# EAGLE design T-Board-328 PCB - v0.3 (EAGLE 6.5.0)
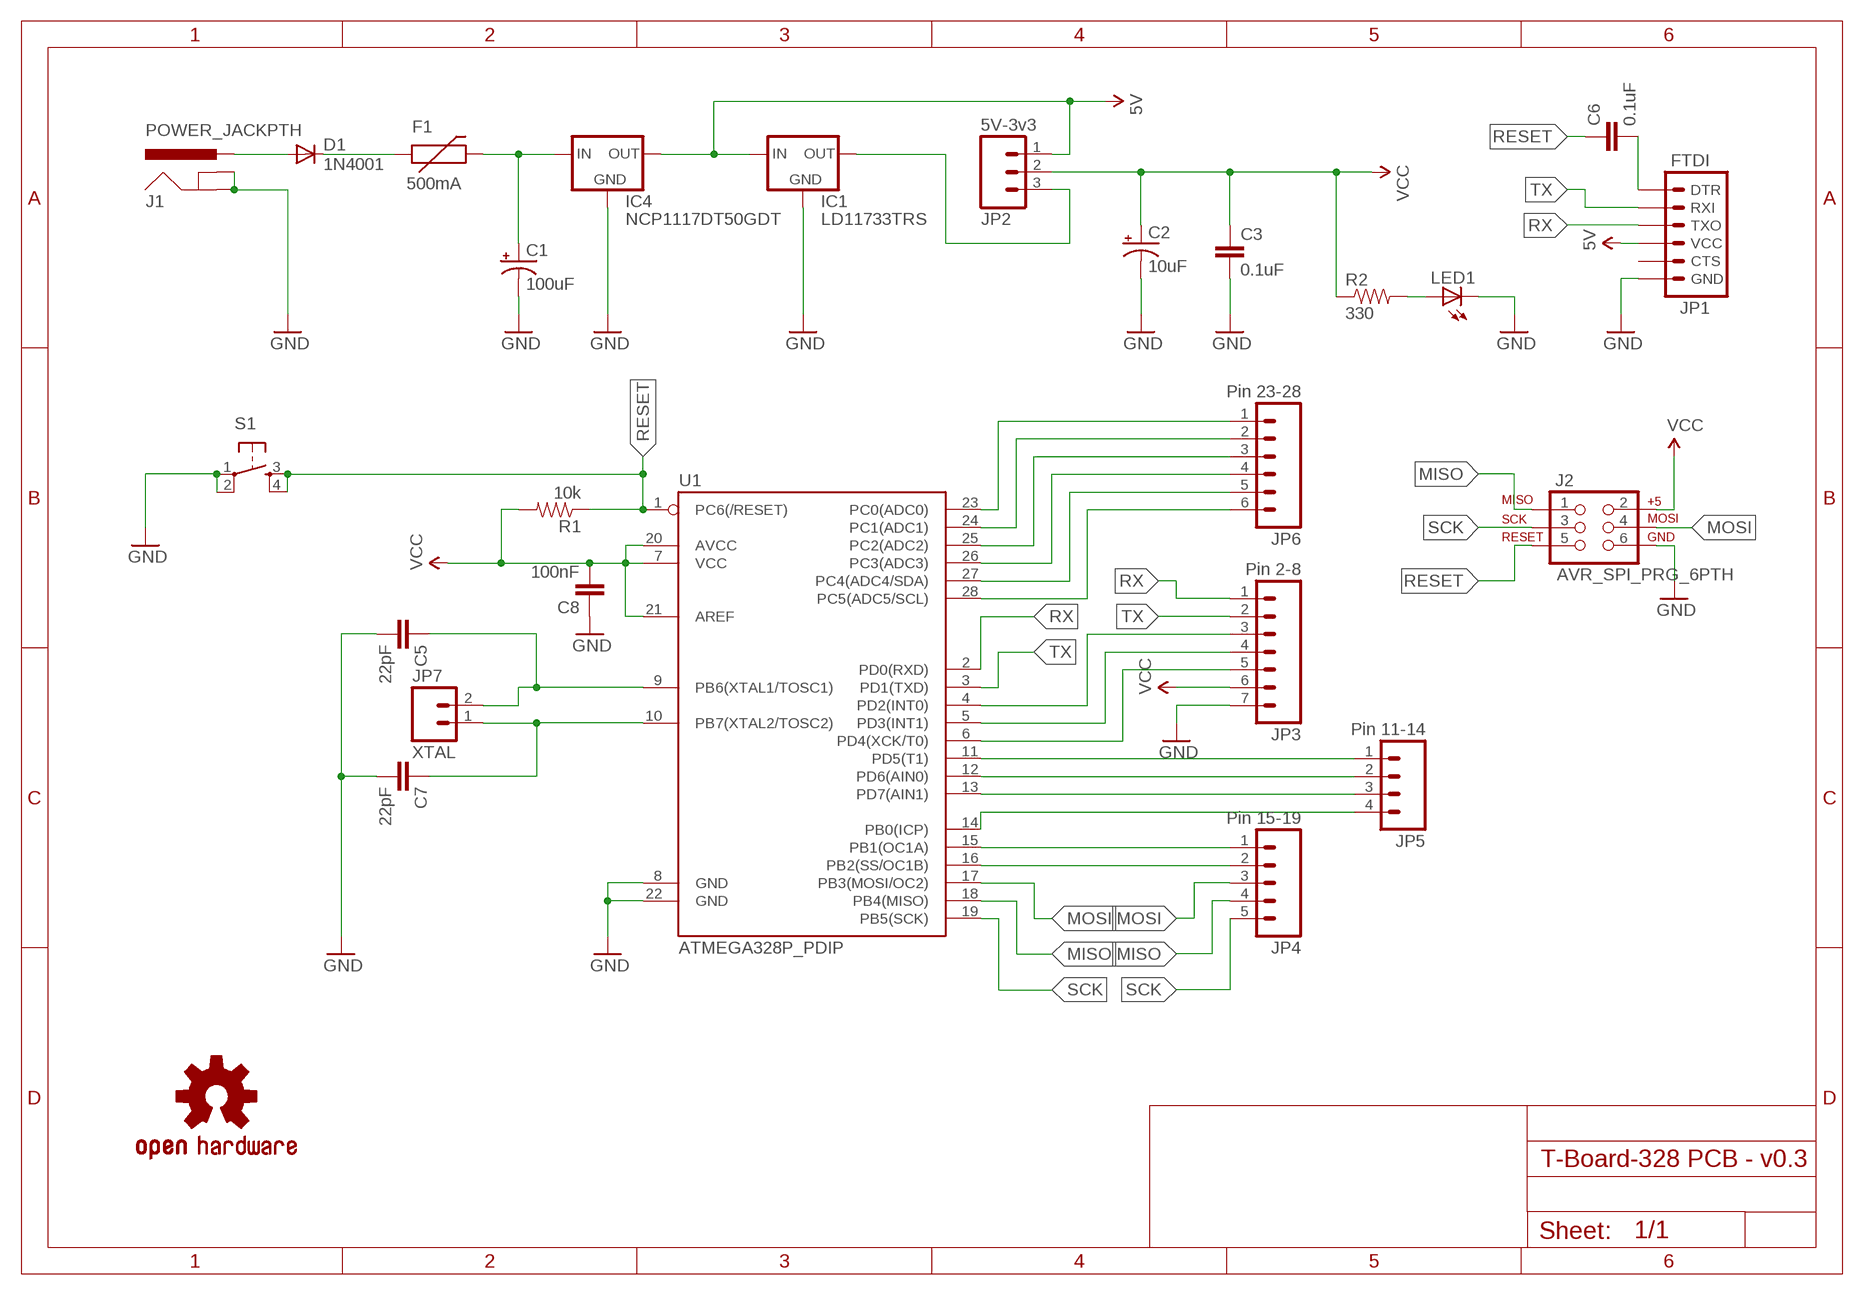
[diagram p0: schematic, sheet 1]

## Parts
C1  100uF  CAP_POLPTH1  [CPOL-RADIAL-100UF-25V]
C2  10uF  CAP_POLPTH2  [CPOL-RADIAL-10UF-25V]
C3  0.1uF  CAP1206  [1206]
C5  22pF  CAP1206  [1206]
C6  0.1uF  CAP1206  [1206]
C7  22pF  CAP1206  [1206]
C8  100nF  CAP1206  [1206]
D1  1N4001  DIODEPTH  [DIODE-1N4001]
F1  500mA  PTCPTH  [PTC]
IC1  LD11733TRS  [SOT223]
IC4  NCP1117DT50GDT  [DPACK]
J1  POWER_JACKPTH  [POWER_JACK_PTH]
J2  AVR_SPI_PRG_6PTH  [2X3]
JP1  FTDI  ARDUINO_SERIAL_PROGRAMLONGPADS  [1X06_LONGPADS]
JP2  5V-3v3  M03PTH  [1X03]
JP3  Pin 2-8  M07  [1X07]
JP4  Pin 15-19  M05PTH  [1X05]
JP5  Pin 11-14  M04-NON-POLARPTH  [1X04]
JP6  Pin 23-28  M06SIP  [1X06]
JP7  XTAL  M02PTH  [1X02]
LED1  LED1206  [LED-1206]
LOGO1  OSHW-LOGOS  [OSHW-LOGO-S]
R1  10k  RESISTOR1206  [1206]
R2  330  RESISTOR1206  [1206]
S1  TAC_SWITCHPTH  [TACTILE-PTH]
U1  ATMEGA328P_PDIP  [DIL28-3]

## Nets
5V: IC1.3(IN) IC4.4(OUT) JP1.4(VCC) JP2.1
GND: C1.2(-) C2.2(-) C3.2 C5.2 C7.2 C8.1 IC1.1(GND) IC4.1(GND) J1.GND J1.GNDBREAK J2.6 JP1.6(GND) JP3.7 LED1.C S1.1 S1.2 U1.8(GND) U1.22(GND)
MISO: J2.1 JP4.4 U1.18(PB4(MISO))
MOSI: J2.4 JP4.3 U1.17(PB3(MOSI/OC2))
N$1: D1.A J1.PWR
N$2: JP6.1 U1.23(PC0(ADC0))
N$3: D1.C F1.P$1
N$4: C1.1(+) F1.P$2 IC4.3(IN)
N$5: JP6.2 U1.24(PC1(ADC1))
N$6: C6.2 JP1.1(DTR)
N$7: C7.1 JP7.1 U1.10(PB7(XTAL2/TOSC2))
N$8: C5.1 JP7.2 U1.9(PB6(XTAL1/TOSC1))
N$9: LED1.A R2.2
N$10: IC1.4(OUT) JP2.3
N$13: JP5.1 U1.11(PD5(T1))
N$14: JP5.2 U1.12(PD6(AIN0))
N$15: JP5.3 U1.13(PD7(AIN1))
N$16: JP5.4 U1.14(PB0(ICP))
N$17: JP4.1 U1.15(PB1(OC1A))
N$18: JP4.2 U1.16(PB2(SS/OC1B))
N$19: JP6.3 U1.25(PC2(ADC2))
N$20: JP6.4 U1.26(PC3(ADC3))
N$21: JP6.5 U1.27(PC4(ADC4/SDA))
N$22: JP6.6 U1.28(PC5(ADC5/SCL))
N$24: JP3.3 U1.4(PD2(INT0))
N$25: JP3.4 U1.5(PD3(INT1))
N$26: JP3.5 U1.6(PD4(XCK/T0))
RESET: C6.1 J2.5 R1.1 S1.3 S1.4 U1.1(PC6(/RESET))
RX: JP1.3(TXO) JP3.1 U1.2(PD0(RXD))
SCK: J2.3 JP4.5 U1.19(PB5(SCK))
TX: JP1.2(RXI) JP3.2 U1.3(PD1(TXD))
VCC: C2.1(+) C3.1 C8.2 J2.2 JP2.2 JP3.6 R1.2 R2.1 U1.7(VCC) U1.20(AVCC) U1.21(AREF)
Unconnected: JP1.5(CTS)

## Library data of the parts
C1 C2 = SparkFun-Capacitors:CAP_POL: Capacitor Polarized These are standard SMD and PTH capacitors. Normally 10uF, 47uF, and 100uF in electrolytic and tantalum varieties. Always verify the external diameter of the through hole cap, it varies with capacity, voltage, and manufacturer. The EIA devices should be standard.
C3 C5-C8 = SparkFun-Passives:CAP: Capacitor Standard 0603 ceramic capacitor, and 0.1" leaded capacitor.
D1 = SparkFun-DiscreteSemi:DIODE: Diode These are standard reverse protection diodes and small signal diodes. SMA package can handle up to about 1A. SOD-323 can handle about 200mA. What the SOD-323 package when ordering, there are some mfgs out there that are 5-pin packages.
F1 = SparkFun-PowerIC:PTC: Resettable Fuse PTC Resettable Fuse. Spark Fun Electronics SKU : COM-08357
IC1 = AndyTallack:LD117: Low drop fixed and adjustable positive voltage regulators 1 A Source: http://www.st.com/stonline/products/literature/ds/7194/ld1117axx.pdf
IC4 = AndyTallack:NCP1117: NCP1117 ON Semiconductor low dropout fixed voltage regulator; VOUT: 5V
J1 = SparkFun-Connectors:POWER_JACK: Power Jack This is the standard 5.5mm barrel jack for power. The PTH is the most common, proven, reliable, footprint. The Slot footprint only works if the mill layer is transmitted to the PCB fab house so be warned. Mating wall wart : TOL-00298 (and others); PROD_ID: PRT-00119
J2 = SparkFun-Connectors:AVR_SPI_PRG_6: AVR ISP 6 Pin This is the reduced ISP connector for AVR programming. Common on Arduino. This footprint will take up less PCB space and can be used with a 10-pin to 6-pin adapter such as SKU: BOB-08508
JP1 = SparkFun-Connectors:ARDUINO_SERIAL_PROGRAM: FTDI connector footprints
JP2 = SparkFun-Connectors:M03: Header 3 Standard 3-pin 0.1" header. Use with straight break away headers (SKU : PRT-00116), right angle break away headers (PRT-00553), swiss pins (PRT-00743), machine pins (PRT-00117), and female headers (PRT-00115). Molex polarized connector foot print use with SKU : PRT-08232 with associated crimp pins and housings.
JP3 = SparkFun-Connectors:M07: Header 7 Standard 7-pin 0.1" header. Use with straight break away headers (SKU : PRT-00116), right angle break away headers (PRT-00553), swiss pins (PRT-00743), machine pins (PRT-00117), and female headers (PRT-00115). NOTES ON THE VARIANTS LOCK and LOCK_LONGPADS... This footprint was designed to help hold the alignment of a through-hole component (i.e. 7-pin header) while soldering it into place. You may notice that each hole has been shifted either up or down by 0.005 of an inch from it's more standard position (which is usually a perfectly straight line). This slight alteration caused the pins (the squares in the middle) to touch the edges of the holes. Because they are alternating, it causes a "brace" to hold the header in place. 0.005 has proven to be the perfect amount of "off-center" position when using our standard breakaway headers. Although looks a little odd when you look at the bare footprint, once you have a header in there, the alteration is very hard to notice. Also, if you push a header all the way into place, it is covered up entirely on the bottom side. This idea of altering the position of holes to aid alignment will be further integrated into the Sparkfun Library for other footprints. It can help hold any component with 3 or more connection pins.
JP4 = SparkFun-Connectors:M05: Header 5 Standard 5-pin 0.1" header. Use with straight break away headers (SKU : PRT-00116), right angle break away headers (PRT-00553), swiss pins (PRT-00743), machine pins (PRT-00117), and female headers (PRT-00115). Molex polarized connector foot print use with SKU : PRT-08230 with associated crimp pins and housings.
JP5 = AndyTallack:M04-NON-POLAR: Header 4 Standard 4-pin 0.1" header. Use with straight break away headers (SKU : PRT-00116), right angle break away headers (PRT-00553), swiss pins (PRT-00743), machine pins (PRT-00117), and female headers (PRT-00115). Molex polarized connector foot print use with SKU : PRT-08231 with associated crimp pins and housings. 1MM SMD Version SKU: PRT-10208
JP6 = SparkFun-Connectors:M06: Header 6 Standard 6-pin 0.1" header. Use with straight break away headers (SKU : PRT-00116), right angle break away headers (PRT-00553), swiss pins (PRT-00743), machine pins (PRT-00117), and female headers (PRT-00115). Molex polarized connector foot print use with SKU : PRT-08094 with associated crimp pins and housings. NOTES ON THE VARIANTS LOCK and LOCK_LONGPADS... This footprint was designed to help hold the alignment of a through-hole component (i.e. 6-pin header) while soldering it into place. You may notice that each hole has been shifted either up or down by 0.005 of an inch from it's more standard position (which is a perfectly straight line). This slight alteration caused the pins (the squares in the middle) to touch the edges of the holes. Because they are alternating, it causes a "brace" to hold the component in place. 0.005 has proven to be the perfect amount of "off-center" position when using our standard breakaway headers. Although looks a little odd when you look at the bare footprint, once you have a header in there, the alteration is very hard to notice. Also,if you push a header all the way into place, it is covered up entirely on the bottom side. This idea of altering the position of holes to aid alignment will be further integrated into the Sparkfun Library for other footprints. It can help hold any component with 3 or more connection pins.
JP7 = SparkFun-Connectors:M02: Standard 2-pin 0.1" header. Use with - straight break away headers ( PRT-00116) - right angle break away headers (PRT-00553) - swiss pins (PRT-00743) - machine pins (PRT-00117) - female headers (PRT-00115) Molex polarized connector foot print use with: PRT-08233 with associated crimp pins and housings. 2.54_SCREWTERM for use with PRT-10571. 3.5mm Screw Terminal footprints for PRT-08084 5mm Screw Terminal footprints for use with PRT-08433
LED1 = SparkFun-LED:LED: LEDs Standard schematic elements and footprints for 5mm, 3mm, 1206, and 0603 sized LEDs. 5mm - Spark Fun Electronics SKU : COM-00529 (and others)
LOGO1 = SparkFun-Aesthetics:OSHW-LOGO: Open Source Hardware Logo This logo indicates the piece of hardware it is found on incorporates a OSHW license and/or adheres to the definition of open source hardware found here: http://freedomdefined.org/OSHW
R1 R2 = SparkFun-Passives:RESISTOR: Resistor Basic schematic elements and footprints for 0603, 1206, and PTH resistors.
S1 = SparkFun-Electromechanical:TAC_SWITCH: Momentary Switch Button commonly used for reset or general input. Spark Fun Electronics SKU : COM-00097 SMT- SWCH-08247
U1 = SparkFun-DigitalIC:ATMEGA328P_PDIP: uC used in the Arduino 32kb flash, 1k EEPROM, 2k SRAM This is the through-hole version of this chip.

## Net classes
0 default: width 0.254 mm, drill 0.33 mm, clearance 0.254 mm

## Board
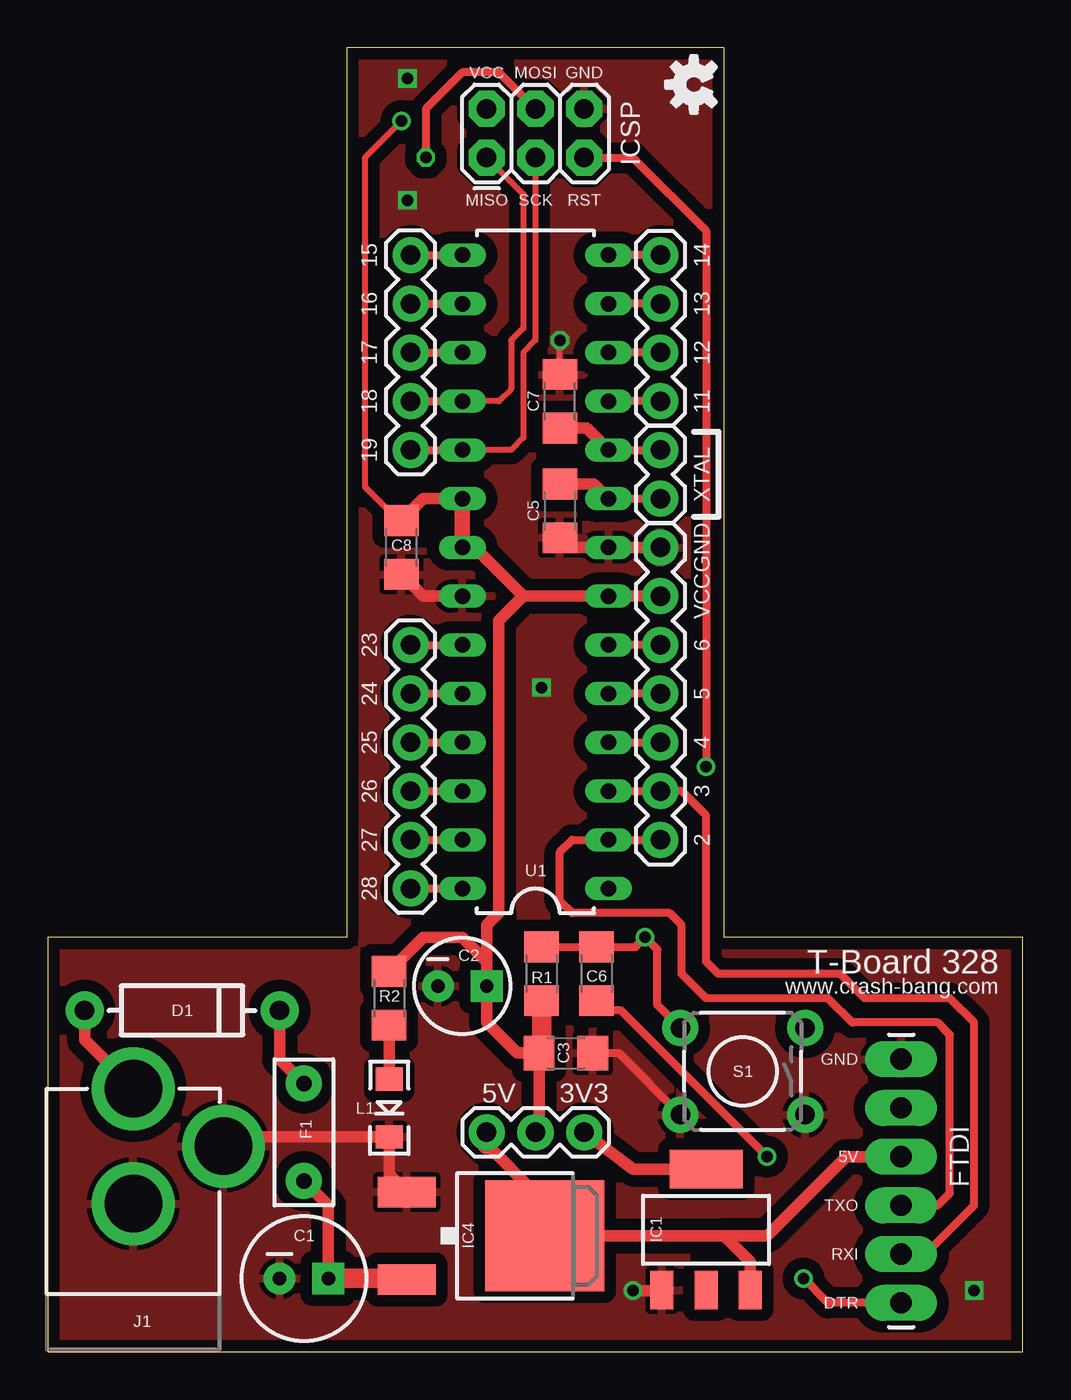
[diagram p1: board, top side]
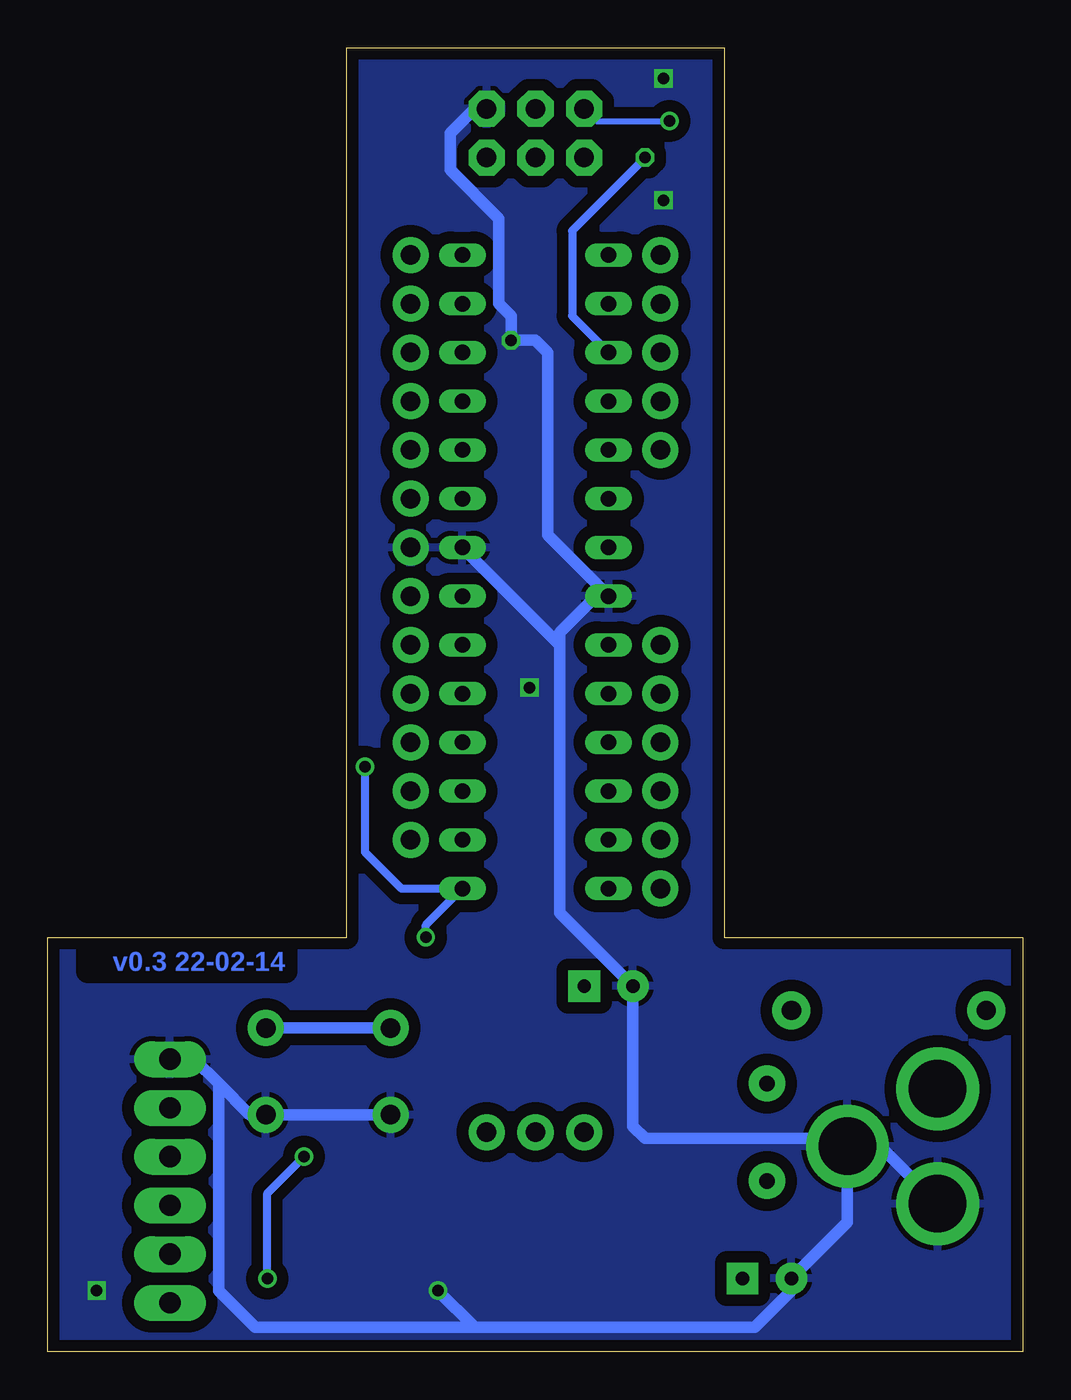
[diagram p2: board, bottom side, seen from below]

Size 50.8 x 67.94 mm. Coordinates in mm from the lower left corner, seen from the top.
Outline: 0,0 50.8,0 50.8,21.59 35.24,21.59 35.24,67.94 15.56,67.94 15.56,21.59 0,21.59 0,0
Copper layers (1*16): Top 0.0356mm / dielectric 1.5011mm / Bottom 0.0356mm
Design rules "T-Board-328 v0.3g": minimum track width 6mil, minimum drill 13mil, track to track 0.205mm, track to pad 0.205mm, pad to pad 0.205mm, via to via 0.205mm, smd to smd 6mil, copper to edge 15mil, drill to drill 6mil, minimum pad ring 7mil, minimum via ring 7mil, stop-mask expansion 3mil, vias tented up to drill 0mil, thermal gap 10mil

### Footprints (pad centres in the part's own frame; a part is rotated, then mirrored left to right if it is on the bottom)
CPOL-RADIAL-100UF-25V = drill 0.7 pad 1.651 square: 1 1.27,0 | drill 0.7 pad 1.651: 2 -1.27,0
CPOL-RADIAL-10UF-25V = drill 0.7 pad 1.651 square: 1 1.27,0 | drill 0.7 pad 1.651: 2 -1.27,0
1206 = smd 1.6 x 1.8: 1 -1.4,0; 2 1.4,0
DIODE-1N4001 = drill 1 pad 1.981: A -5.08,0; C 5.08,0
PTC = drill 0.8 pad 1.88: P$1 -2.54,0; P$2 2.54,0
SOT223 = smd 1.2 x 2: 1 -2.3,-3.15; 2 0,-3.15; 3 2.3,-3.15 | smd 3.8 x 2: 4 0,3.15
DPACK = smd 1.6 x 3: 1 -2.28,-4.8; 3 2.28,-4.8 | smd 5.8 x 6.2: 4 0,2.38
POWER_JACK_PTH = drill 2.997 pad 4.318: GND 0,7.7; GNDBREAK 4.7,10.7; PWR 0,13.7
2X3 = drill 1.016 pad 1.88 octagon: 1 0,0; 2 0,2.54; 3 2.54,0; 4 2.54,2.54; 5 5.08,0; 6 5.08,2.54
1X06_LONGPADS = drill 1.118 pad 1.88 long: 1 0,0; 2 2.54,0; 3 5.08,0; 4 7.62,0; 5 10.16,0; 6 12.7,0
1X03 = drill 1.016 pad 1.88: 1 0,0; 2 2.54,0; 3 5.08,0
1X07 = drill 1.016 pad 1.88: 1 0,0; 2 2.54,0; 3 5.08,0; 4 7.62,0; 5 10.16,0; 6 12.7,0; 7 15.24,0
1X05 = drill 1.016 pad 1.88: 1 0,0; 2 2.54,0; 3 5.08,0; 4 7.62,0; 5 10.16,0
1X04 = drill 1.016 pad 1.88: 1 0,0; 2 2.54,0; 3 5.08,0; 4 7.62,0
1X06 = drill 1.016 pad 1.88: 1 0,0; 2 2.54,0; 3 5.08,0; 4 7.62,0; 5 10.16,0; 6 12.7,0
1X02 = drill 1.016 pad 1.88: 1 0,0; 2 2.54,0
LED-1206 = smd 1.2 x 1.4: A -1.5,0; C 1.5,0
TACTILE-PTH = drill 1.016 pad 1.88: 1 -3.251,2.261; 2 3.251,2.261; 3 -3.251,-2.261; 4 3.251,-2.261
DIL28-3 = drill 0.813 long: 1 -16.51,-3.81; 2 -13.97,-3.81; 3 -11.43,-3.81; 4 -8.89,-3.81; 5 -6.35,-3.81; 6 -3.81,-3.81; 7 -1.27,-3.81; 8 1.27,-3.81; 9 3.81,-3.81; 10 6.35,-3.81; 11 8.89,-3.81; 12 11.43,-3.81; 13 13.97,-3.81; 14 16.51,-3.81; 15 16.51,3.81; 16 13.97,3.81; 17 11.43,3.81; 18 8.89,3.81; 19 6.35,3.81; 20 3.81,3.81; 21 1.27,3.81; 22 -1.27,3.81; 23 -3.81,3.81; 24 -6.35,3.81; 25 -8.89,3.81; 26 -11.43,3.81; 27 -13.97,3.81; 28 -16.51,3.81

### Placement (x,y rotation side)
C1  13.34,3.81 0 top
C2  21.59,19.05 0 top
C3  26.99,15.56 0 top
C5  26.67,43.81 270 top
C6  28.57,19.68 270 top
C7  26.67,49.53 90 top
C8  18.41,41.91 90 top
D1  6.99,17.78 0 top
F1  13.34,11.43 270 top
IC1  34.29,6.35 0 top
IC4  23.5,6.03 270 top
J1  4.45,0 0 top
J2  22.86,62.23 0 top
JP1  44.45,2.54 90 top
JP2  22.86,11.43 0 top
JP3  31.91,26.67 90 top
JP4  18.89,57.15 270 top
JP5  31.91,49.53 90 top
JP6  18.89,36.83 270 top
JP7  31.91,46.99 270 top
LED1  17.78,12.7 270 top
LOGO1  33.65,66.04 90 top
R1  25.72,19.68 270 top
R2  17.78,18.41 270 top
S1  36.2,14.61 180 top
U1  25.4,40.64 90 top

### Tracks (layer width: path | path; a pad name or v marks a point on that pad's centre or on a via)
5V
  Top 0.61: IC4.4 35.24,6.03 | 35.24,6.03 36.59,4.68 IC1.3 | JP1.4 41.59,10.16 37.46,6.03 35.24,6.03 | 22.86,10.79 25.4,8.26
  Top 1.016: JP2.1 22.86,10.79 | 25.4,8.26 25.4,6.51 IC4.4
GND  (via drill 0.6)
  Top 0.305: C7.2 v26.67,52.7
  Top 0.406: C3.2 29.73,15.56 S1.2
  Top 0.61: 27.18,41.91 C5.2 26.67,41.91 U1.8 JP3.7 | IC1.1 31.96,3.17 v30.48,3.17 | C8.1 19.55,39.37 U1.22 | IC4.1 17.78,9.23 LED1.C 9.64,11.2 J1.GNDBREAK
  Bottom 0.61: J1.GND 7.45,10.7 J1.GNDBREAK | J1.GNDBREAK 9.14,6.73 C1.2 12.07,3.17 13.97,1.27 28.57,1.27 | S1.2 S1.1 40.28,12.34 41.91,13.97 | J2.6 28.57,64.77 29.84,63.5 29.84,61.59 27.3,59.05 27.3,54.61 26.67,53.98 v26.67,52.7 25.4,52.7 24.77,52.07 24.77,42.55 U1.22 22.23,39.37 24.13,37.47 24.13,36.83 | v30.48,3.17 28.57,1.27 | 24.13,36.83 24.13,22.86 C2.2 20.32,11.75 19.68,11.11 9.56,11.11 J1.GNDBREAK | JP1.6 43.18,15.24 41.91,13.97 | 41.91,13.97 41.91,3.17 40,1.27 28.57,1.27 | U1.8 24.13,36.83
  other vias: 18.73,66.36 18.73,60.01 25.72,34.61 48.26,3.17
  pour Bottom (isolate 0.61): 15.56,67.94 35.24,67.94 35.24,21.59 50.8,21.59 50.8,0 0,0 0,21.59 15.56,21.59
  pour Top (isolate 0.61): 15.56,67.94 35.24,67.94 35.24,21.59 50.8,21.59 50.8,0 0,0 0,21.59 15.56,21.59
MISO
  Top 0.305: J2.1 24.77,60.33 24.77,53.34 24.13,52.7 24.13,50.16 23.5,49.53 U1.18
  Top 0.406: JP4.4 U1.18
MOSI  (via drill 0.6)
  Top 0.406: J2.4 23.5,66.67 21.59,66.67 19.68,64.77 v19.68,62.23 | JP4.3 U1.17
  Bottom 0.406: v19.68,62.23 23.5,58.42 23.5,53.98 U1.17
N$1
  Top 0.61: J1.PWR 1.9,16.24 D1.A
N$2
  Top 0.406: JP6.1 U1.23
N$3
  Top 0.61: D1.C 12.07,15.24 F1.P$1
N$4
  Top 0.61: F1.P$2 14.61,7.62 C1.1
  Top 1.016: C1.1 18.7,3.81 IC4.3
N$5
  Top 0.406: JP6.2 U1.24
N$6  (via drill 0.6)
  Top 0.406: JP1.1 40.64,2.54 v39.37,3.81 | v37.46,10.16 29.84,17.78 29.08,17.78 C6.2
  Bottom 0.406: v39.37,3.81 39.37,8.26 v37.46,10.16
N$7
  Top 0.406: U1.10 JP7.1
  Top 0.61: U1.10 28.07,48.13 C7.1
N$8
  Top 0.406: U1.9 JP7.2
  Top 0.61: U1.9 28.45,45.22 C5.1
N$9
  Top 0.61: R2.2 LED1.A
N$10
  Top 0.61: JP2.3 30.5,9.5 IC1.4
N$13
  Top 0.406: JP5.1 U1.11
N$14
  Top 0.406: JP5.2 U1.12
N$15
  Top 0.406: JP5.3 U1.13
N$16
  Top 0.406: JP5.4 U1.14
N$17
  Top 0.406: JP4.1 U1.15
N$18
  Top 0.406: JP4.2 U1.16
N$19
  Top 0.406: JP6.3 U1.25
N$20
  Top 0.406: JP6.4 U1.26
N$21
  Top 0.406: JP6.5 U1.27
N$22
  Top 0.406: JP6.6 U1.28
N$24
  Top 0.406: U1.4 JP3.3
N$25
  Top 0.406: JP3.4 U1.5
N$26
  Top 0.406: JP3.5 U1.6
RESET  (via drill 0.6)
  Top 0.406: J2.5 30.48,62.23 34.29,58.42 v34.29,30.48 | R1.1 C6.1 30.61,21.09 v31.11,21.59 31.75,20.95 31.75,18.06 S1.4
  Bottom 0.406: v34.29,30.48 34.29,26.04 32.38,24.13 U1.1 31.11,22.23 v31.11,21.59
  Bottom 0.61: S1.4 S1.3
RX
  Top 0.406: JP3.1 U1.2 27.3,26.67 26.67,26.04 26.67,23.5 27.3,22.86 32.38,22.86 33.02,22.23 33.02,19.68 34.29,18.41 40.64,18.41 41.91,17.14 46.35,17.14 46.99,16.51 46.99,8.26 46.35,7.62 JP1.3
SCK
  Top 0.305: J2.3 25.4,52.7 24.77,52.07 24.77,47.62 24.13,46.99 U1.19
  Top 0.406: JP4.5 U1.19
TX
  Top 0.406: U1.3 JP3.2 33.02,29.21 34.29,27.94 34.29,20.32 34.92,19.68 41.27,19.68 42.54,18.41 46.99,18.41 48.26,17.14 48.26,7.62 45.72,5.08 JP1.2
VCC  (via drill 0.6)
  Top 0.305: v18.41,64.14 16.51,62.23 16.51,45.09 18.29,43.31 C8.2
  Top 0.406: U1.21 22.23,41.91
  Top 0.61: JP3.6 U1.7 24.77,39.37 | 25.59,11.62 C3.1 24.45,15.56 22.86,17.14 C2.1 | R2.1 19.55,21.59 21.59,21.59 22.86,20.32 C2.1 | C2.1 22.86,22.23 23.5,22.86 23.5,38.1 24.77,39.37 | 22.23,41.91 24.77,39.37 | C8.2 19.55,44.45 U1.20
  Top 0.813: U1.20 U1.21
  Top 1.016: JP2.2 25.59,11.62 | R1.2 25.72,15.69 C3.1
  Bottom 0.305: J2.2 22.23,64.14 v18.41,64.14

### Text on the board
Bottom: v0.3 22-02-14
tNames: VCC | MOSI | GND | ICSP | MISO | SCK | RST | 15 | 14 | 16 | 13 | 17 | 12 | 18 | 11 | 19 | XTAL | GND | VCC | 23 | 6 | 24 | 5 | 25 | 4 | 26 | 3 | 27 | 2 | 28 | T-Board 328 | www.crash-bang.com | S1 | GND | 5V | 3V3 | L1 | 5V | FTDI | TXO | RXI | DTR